# Altium schematic sheet AIWAC-Camera Pinboard-V02.SchDoc
size A4
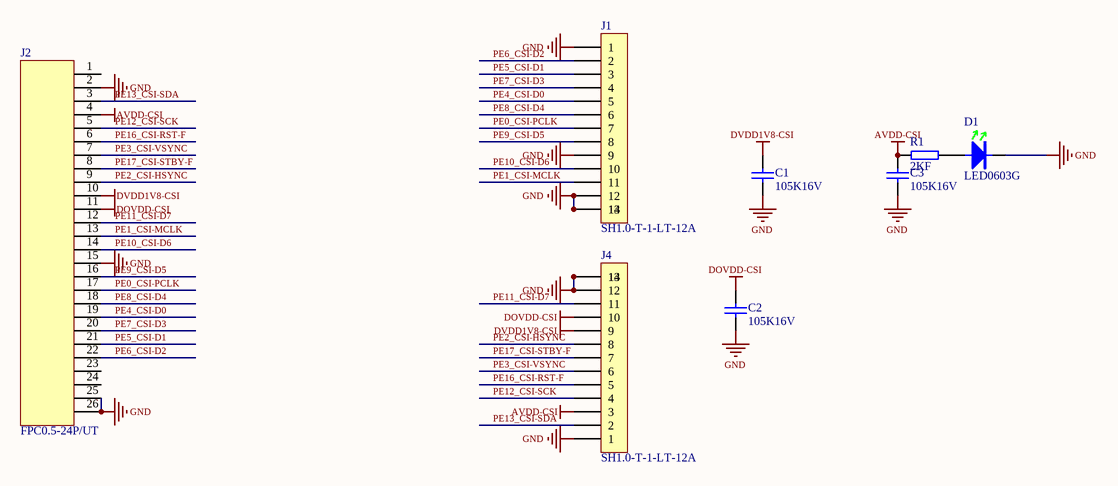
[diagram p0: AIWAC-Camera Pinboard-V02.SchDoc]

## Parts
C1  105K16V  [C0603]
C2  105K16V  [C0603]
C3  105K16V  [C0603]
D1  LED0603G  [D-LED0603G]
J1  SH1.0-T-1-LT-12A  [J-SH1.0-T-1-LT-12A]
J2  FPC0.5-24P/UT  [FPC0.5-24P/UT]
J4  SH1.0-T-1-LT-12A  [J-SH1.0-T-1-LT-12A]
R1  2KF  [R0603]

## Nets
AVDD-CSI: C3.1 J2.4 J4.3 R1.1
DOVDD-CSI: C2.1 J2.11 J4.10
DVDD1V8-CSI: C1.1 J2.10 J4.9
GND: C1.2 C2.2 C3.2 D1.2 J1.1 J1.9 J1.12 J1.13 J1.14 J2.2 J2.15 J2.25 J2.26 J4.1 J4.12 J4.13 J4.14
PE0_CSI-PCLK: J1.7 J2.17
PE1_CSI-MCLK: J1.11 J2.13
PE2_CSI-HSYNC: J2.9 J4.8
PE3_CSI-VSYNC: J2.7 J4.6
PE4_CSI-D0: J1.5 J2.19
PE5_CSI-D1: J1.3 J2.21
PE6_CSI-D2: J1.2 J2.22
PE7_CSI-D3: J1.4 J2.20
PE8_CSI-D4: J1.6 J2.18
PE9_CSI-D5: J1.8 J2.16
PE10_CSI-D6: J1.10 J2.14
PE11_CSI-D7: J2.12 J4.11
PE12_CSI-SCK: J2.5 J4.4
PE13_CSI-SDA: J2.3 J4.2
PE16_CSI-RST-F: J2.6 J4.5
PE17_CSI-STBY-F: J2.8 J4.7
NetD1_1: D1.1 R1.2

Not connected (* = marked no-connect by the designer): J2 1 23 24

## Library data of the parts
C1-C3 = C0603X7R-105K16V: 贴片电容-陶瓷; 规格型号: 1uF±10%_16V_X7R_C0603; 生产商: 风华 三星; 供应商: *; 备注: *
D1 = DLED-0603-G: 贴片二极管-LED; 规格型号: 0603-GREEN; 货品编码: 无样品无编码; 生产商: *; 供应商: *; 备注: *
J1 J4 = SH1.0-T-1-LT-12A: 接插件-SH1.0-T-1-LT-12A; 规格型号: 1.0m立式贴片插座12P/SH1.0-T-1-LT-12A; 供应商: *; 备注: *
J2 = J-FPC0.5-24P/UT: FPC端子; 规格型号: FPC0.5-24P/UT 24P 脚间距0.5mm 上接触 推进式; 货品编码: 样品无编码; 供应商: *; 备注: *
R1 = R0603-2KF: 贴片电阻-通用; 生产商: 厚声 国巨; 规格型号: 2K±1%_1/10W_±200ppm_R0603; 备注: *; 供应商: *